# EAGLE design ME433_2017_1 (EAGLE 8.1.0)
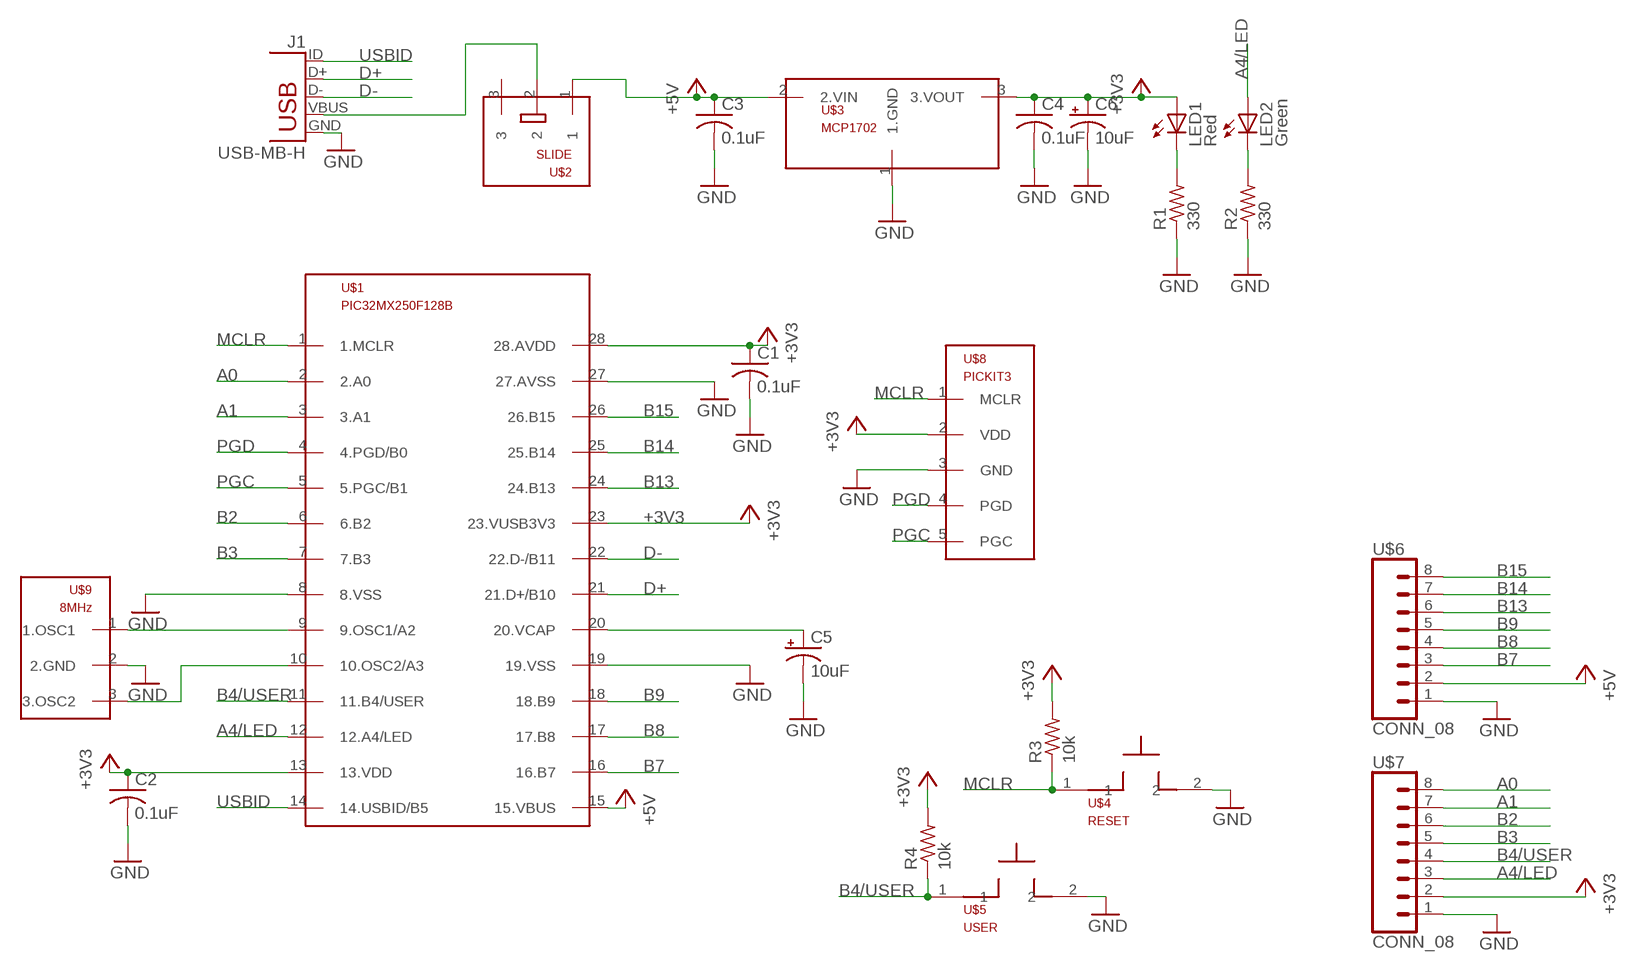
[diagram p0: schematic, sheet 1]

## Parts
C1  0.1uF  C-US025-025X050  [C025-025X050]
C2  0.1uF  C-US025-025X050  [C025-025X050]
C3  0.1uF  C-US025-025X050  [C025-025X050]
C4  0.1uF  C-US025-025X050  [C025-025X050]
C5  10uF  CPOL-USB45181B  [B45181B]
C6  10uF  CPOL-USB45181B  [B45181B]
J1  USB-MB-H  [USB-MB-H]
LED1  Red  LED3MM  [LED3MM]
LED2  Green  LED3MM  [LED3MM]
R1  330  R-US_0207/10  [0207/10]
R2  330  R-US_0207/10  [0207/10]
R3  10k  R-US_0207/10  [0207/10]
R4  10k  R-US_0207/10  [0207/10]
U$1  PIC32MX250F128B  [DIL28-3]
U$2  SLIDE  [SLIDE]
U$3  MCP1702  [TO92]
U$4  RESET  PB  [PB]
U$5  USER  PB  [PB]
U$6  CONN_08  [1X08]
U$7  CONN_08  [1X08]
U$8  PICKIT3  [1X05]
U$9  8MHz  OSC  [OSC]

## Nets
+3V3: C1.1 C2.1 C4.1 C6.+ LED1.A R3.2 R4.2 U$1.13(13.VDD) U$1.23(23.VUSB3V3) U$1.28(28.AVDD) U$3.3(3.VOUT) U$7.2 U$8.2(VDD)
+5V: C3.1 U$1.15(15.VBUS) U$2.1 U$3.2(2.VIN) U$6.2
A0: U$1.2(2.A0) U$7.8
A1: U$1.3(3.A1) U$7.7
A4/LED: LED2.A U$1.12(12.A4/LED) U$7.3
B2: U$1.6(6.B2) U$7.6
B3: U$1.7(7.B3) U$7.5
B4/USER: R4.1 U$1.11(11.B4/USER) U$5.1 U$7.4
B7: U$1.16(16.B7) U$6.3
B8: U$1.17(17.B8) U$6.4
B9: U$1.18(18.B9) U$6.5
B13: U$1.24(24.B13) U$6.6
B14: U$1.25(25.B14) U$6.7
B15: U$1.26(26.B15) U$6.8
D+: J1.D+ U$1.21(21.D+/B10)
D-: J1.D- U$1.22(22.D-/B11)
GND: C1.2 C2.2 C3.2 C4.2 C5.- C6.- J1.GND R1.1 R2.1 U$1.8(8.VSS) U$1.19(19.VSS) U$1.27(27.AVSS) U$3.1(1.GND) U$4.2 U$5.2 U$6.1 U$7.1 U$8.3(GND) U$9.2(2.GND)
MCLR: R3.1 U$1.1(1.MCLR) U$4.1 U$8.1(MCLR)
N$1: J1.VBUS U$2.2
N$2: LED2.K(C) R2.2
N$4: LED1.K(C) R1.2
N$5: U$1.9(9.OSC1/A2) U$9.1(1.OSC1)
N$6: U$1.10(10.OSC2/A3) U$9.3(3.OSC2)
N$7: C5.+ U$1.20(20.VCAP)
PGC: U$1.5(5.PGC/B1) U$8.5(PGC)
PGD: U$1.4(4.PGD/B0) U$8.4(PGD)
USBID: J1.ID U$1.14(14.USBID/B5)
Unconnected: U$2.3

## Library data of the parts
C1-C4 = resistor:C-US: CAPACITOR, American symbol
C5 C6 = resistor:CPOL-US: POLARIZED CAPACITOR, American symbol
J1 = ME433_2017_1:USB: USB Connectors USB-B-PTH is fully proven SKU : PRT-00139/CONN-08278 USB-miniB is fully proven SKU : PRT-00587 USB-A-PCB is untested. USB-A-H is throughly reviewed, but untested. Spark Fun Electronics SKU : PRT-00437 USB-B-SMT is throughly reviewed, but untested. Needs silkscreen touching up. USB-A-S has not been used/tested USB-MB-H has not been used/tested USB-MICROB has been used. CONN-09505
LED1 LED2 = led:LED: LED OSRAM: - CHIPLED LG R971, LG N971, LY N971, LG Q971, LY Q971, LO R971, LY R971 LH N974, LH R974 LS Q976, LO Q976, LY Q976 LO Q996 - Hyper CHIPLED LW Q18S LB Q993, LB Q99A, LB R99A - SideLED LS A670, LO A670, LY A670, LG A670, LP A670 LB A673, LV A673, LT A673, LW A673 LH A674 LY A675 LS A676, LA A676, LO A676, LY A676, LW A676 LS A679, LY A679, LG A679 - Hyper Micro SIDELED® LS Y876, LA Y876, LO Y876, LY Y876 LT Y87S - SmartLED LW L88C, LW L88S LB L89C, LB L89S, LG L890 LS L89K, LO L89K, LY L89K LS L896, LA L896, LO L896, LY L896 - TOPLED LS T670, LO T670, LY T670, LG T670, LP T670 LSG T670, LSP T670, LSY T670, LOP T670, LYG T670 LG T671, LOG T671, LSG T671 LB T673, LV T673, LT T673, LW T673 LH T674 LS T676, LA T676, LO T676, LY T676, LB T676, LH T676, LSB T676, LW T676 LB T67C, LV T67C, LT T67C, LS T67K, LO T67K, LY T67K, LW E67C LS E67B, LA E67B, LO E67B, LY E67B, LB E67C, LV E67C, LT E67C LW T67C LS T679, LY T679, LG T679 LS T770, LO T770, LY T770, LG T770, LP T770 LB T773, LV T773, LT T773, LW T773 LH T774 LS E675, LA E675, LY E675, LS T675 LS T776, LA T776, LO T776, LY T776, LB T776 LHGB T686 LT T68C, LB T68C - Hyper Mini TOPLED® LB M676 - Mini TOPLED Santana® LG M470 LS M47K, LO M47K, LY M47K Source: http://www.osram.convergy.de LUXEON: - LUMILED® LXK2-PW12-R00, LXK2-PW12-S00, LXK2-PW14-U00, LXK2-PW14-V00 LXK2-PM12-R00, LXK2-PM12-S00, LXK2-PM14-U00 LXK2-PE12-Q00, LXK2-PE12-R00, LXK2-PE12-S00, LXK2-PE14-T00, LXK2-PE14-U00 LXK2-PB12-K00, LXK2-PB12-L00, LXK2-PB12-M00, LXK2-PB14-N00, LXK2-PB14-P00, LXK2-PB14-Q00 LXK2-PR12-L00, LXK2-PR12-M00, LXK2-PR14-Q00, LXK2-PR14-R00 LXK2-PD12-Q00, LXK2-PD12-R00, LXK2-PD12-S00 LXK2-PH12-R00, LXK2-PH12-S00 LXK2-PL12-P00, LXK2-PL12-Q00, LXK2-PL12-R00 Source: www.luxeon.com KINGBRIGHT: KA-3528ASYC Source: www.kingbright.com
R1-R4 = resistor:R-US_: RESISTOR, American symbol
U$1 = ME433_2017_1:PIC32MX250F128B
U$2 = ME433_2017_1:SLIDE
U$3 = ME433_2017_1:MCP1702
U$4 U$5 = ME433_2017_1:PB
U$6 U$7 = ME433_2017_1:CONN_08
U$8 = ME433_2017_1:PICKIT3
U$9 = ME433_2017_1:OSC

## Board
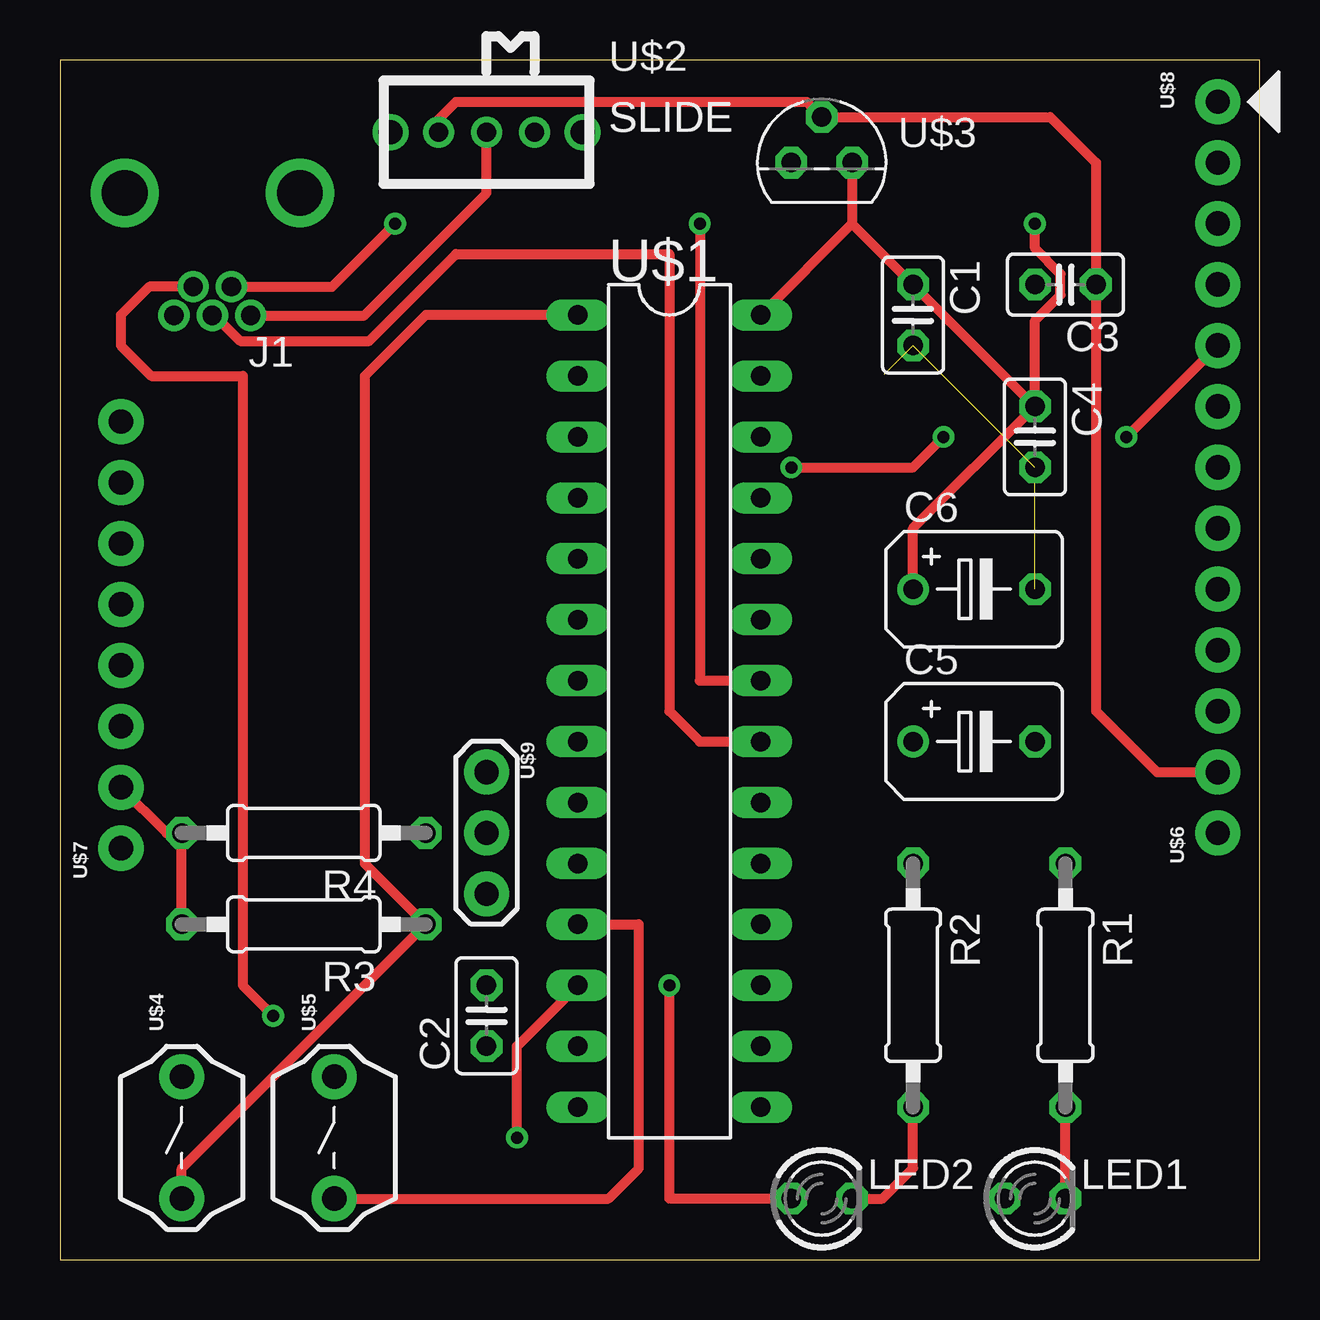
[diagram p1: board, top side]
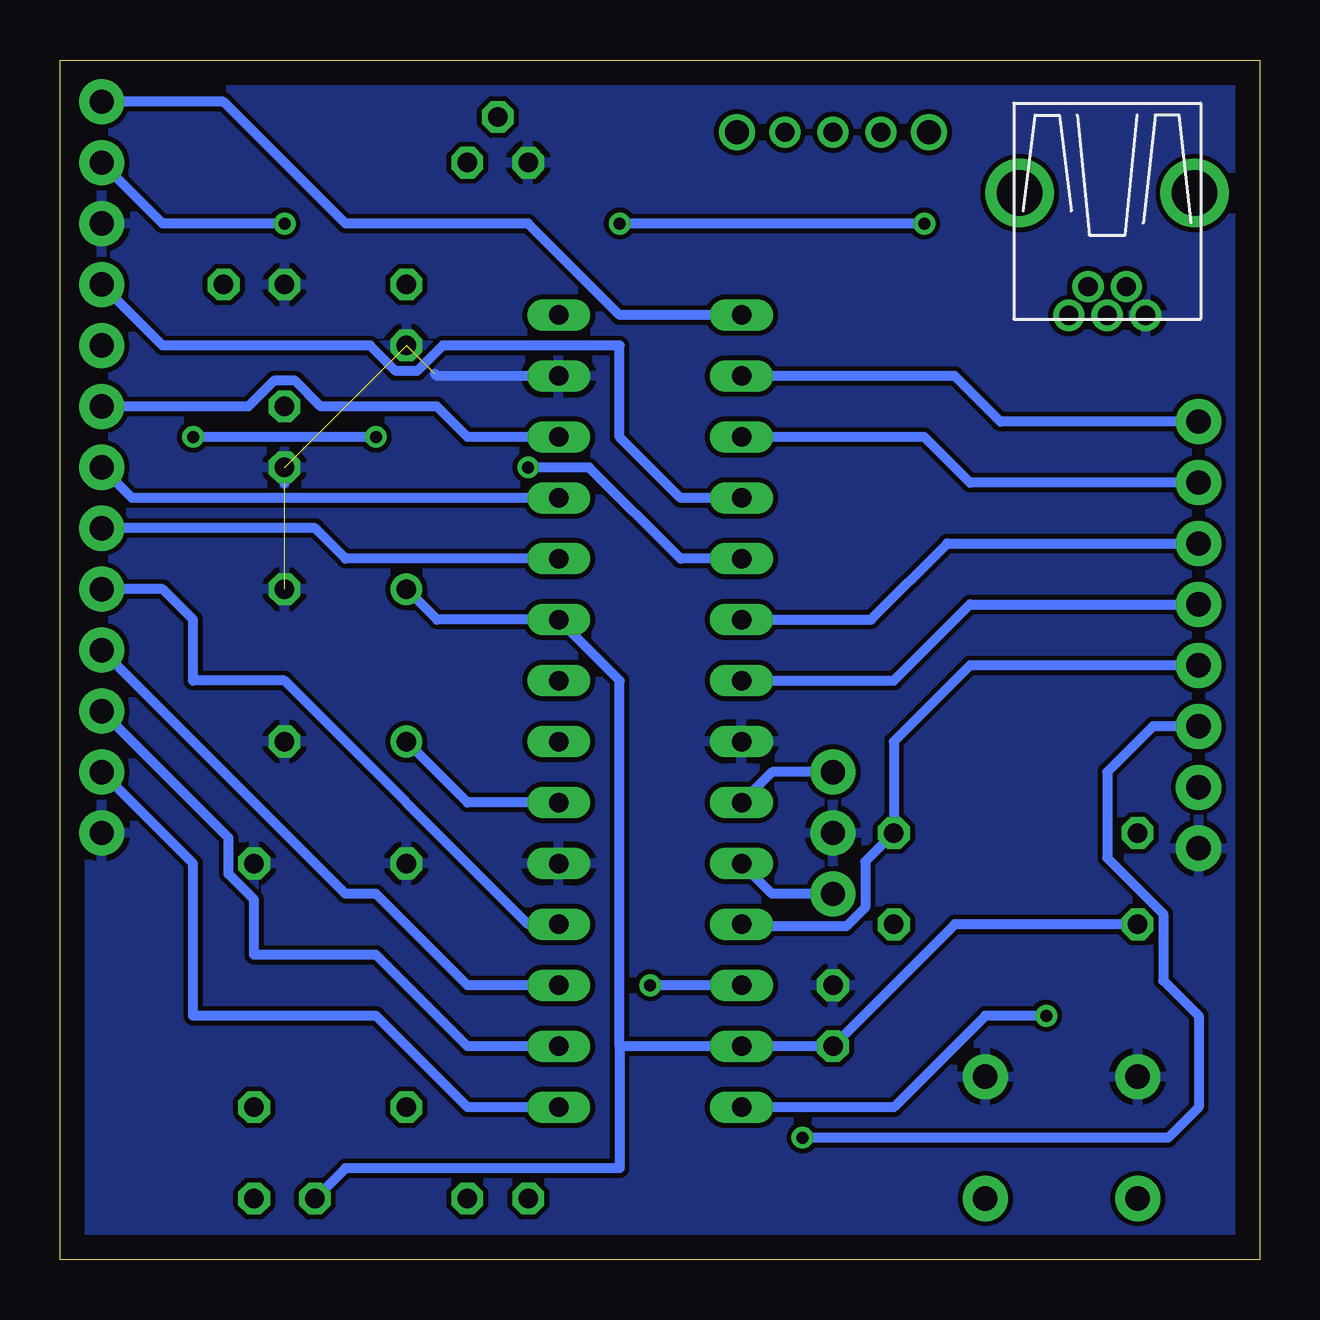
[diagram p2: board, bottom side, seen from below]

Size 50 x 50 mm. Coordinates in mm from the lower left corner, seen from the top.
Outline: 0,0 50,0 50,50 0,50 0,0
Copper layers (1*16): Top 0.035mm / dielectric 1.5mm / Bottom 0.035mm
Design rules "default": minimum track width 10mil, minimum drill 24mil, track to track 8mil, track to pad 8mil, pad to pad 8mil, via to via 8mil, smd to smd 8mil, copper to edge 40mil, drill to drill 8mil, minimum pad ring 10mil, minimum via ring 8mil, stop-mask expansion 4mil, vias tented up to drill 0mil, thermal gap 10mil

### Footprints (pad centres in the part's own frame; a part is rotated, then mirrored left to right if it is on the bottom)
C025-025X050 = drill 0.813 octagon: 1 -1.27,0; 2 1.27,0
B45181B = drill 0.813: + -2.54,0 | drill 0.813 octagon: - 2.54,0
USB-MB-H = drill 0.8: D+ 5.1,0; D- 3.9,0.8; GND 5.1,-1.6; ID 3.9,-0.8; VBUS 5.1,1.6 | drill 1.9: P$6 0,-3.65; P$7 0,3.65
LED3MM = drill 0.813 octagon: A -1.27,0; K 1.27,0
0207/10 = drill 0.813 octagon: 1 -5.08,0; 2 5.08,0
DIL28-3 = drill 0.813 long: 1 -16.51,-3.81; 2 -13.97,-3.81; 3 -11.43,-3.81; 4 -8.89,-3.81; 5 -6.35,-3.81; 6 -3.81,-3.81; 7 -1.27,-3.81; 8 1.27,-3.81; 9 3.81,-3.81; 10 6.35,-3.81; 11 8.89,-3.81; 12 11.43,-3.81; 13 13.97,-3.81; 14 16.51,-3.81; 15 16.51,3.81; 16 13.97,3.81; 17 11.43,3.81; 18 8.89,3.81; 19 6.35,3.81; 20 3.81,3.81; 21 1.27,3.81; 22 -1.27,3.81; 23 -3.81,3.81; 24 -6.35,3.81; 25 -8.89,3.81; 26 -11.43,3.81; 27 -13.97,3.81; 28 -16.51,3.81
SLIDE = drill 0.8: 1 -2,0; 2 0,0; 3 2,0 | drill 1: P$1 -4,0; P$2 4,0
TO92 = drill 0.813 octagon: 1 -1.27,0; 2 0,1.905; 3 1.27,0
PB = drill 1.016 pad 1.88: 1 -2.54,0; 2 2.54,0
1X08 = drill 1.016 pad 1.88: 1 0,0; 2 2.54,0; 3 5.08,0; 4 7.62,0; 5 10.16,0; 6 12.7,0; 7 15.24,0; 8 17.78,0
1X05 = drill 1.016 pad 1.88: 1 0,0; 2 2.54,0; 3 5.08,0; 4 7.62,0; 5 10.16,0
OSC = drill 1.016 pad 1.88: 1 -2.54,0; 2 0,0; 3 2.54,0

### Placement (x,y rotation side)
C1  35.56,39.37 270 top
C2  17.78,10.16 90 top
C3  41.91,40.64 180 top
C4  40.64,34.29 270 top
C5  38.1,21.59 0 top
C6  38.1,27.94 0 top
J1  6.35,44.45 270 top
LED1  40.64,2.54 0 top
LED2  31.75,2.54 0 top
R1  41.91,11.43 270 top
R2  35.56,11.43 270 top
R3  10.16,13.97 180 top
R4  10.16,17.78 180 top
U$1  25.4,22.86 270 top
U$2  17.78,46.99 0 top
U$3  31.75,45.72 0 top
U$4  5.08,5.08 90 top
U$5  11.43,5.08 90 top
U$6  48.26,17.78 90 top
U$7  2.54,17.14 90 top
U$8  48.26,48.26 270 top
U$9  17.78,17.78 270 top

### Tracks (layer width: path | path; a pad name or v marks a point on that pad's centre or on a via)
+3V3  (via drill 0.5)
  Top 0.406: U$3.3 33.02,43.18 | 33.02,43.18 C1.1 C4.1 | 33.02,43.18 U$1.28 | C6.+ 35.56,30.48 C4.1 | R3.2 R4.2 4.45,17.78 U$7.2 | C4.1 40.64,39.13 41.71,40.2 41.71,41.08 40.64,42.15 v40.64,43.18
  Bottom 0.406: R3.2 12.7,13.97 C2.1 U$1.13 26.67,8.89 | 26.67,8.89 26.67,3.81 38.1,3.81 LED1.A | 26.67,8.89 26.67,24.13 U$1.23 34.29,26.67 C6.+ | v40.64,43.18 45.72,43.18 U$8.2
+5V
  Top 0.406: U$2.1 15.78,47.53 16.51,48.26 31.11,48.26 U$3.2 41.27,47.62 43.18,45.72 C3.1 43.18,22.86 45.72,20.32 U$6.2
  Bottom 0.406: U$6.2 44.45,16.51 44.45,10.16 36.83,10.16 33.02,6.35 U$1.15
A0
  Bottom 0.406: U$7.8 10.79,34.92 12.7,36.83 U$1.2
A1
  Bottom 0.406: U$7.7 12.06,32.38 13.97,34.29 U$1.3
A4/LED  (via drill 0.5)
  Top 0.406: LED2.A 25.4,2.54 v25.4,11.43 | v19.05,5.08 19.05,8.89 U$1.12
  Bottom 0.406: U$1.12 v25.4,11.43 | U$7.3 4.45,22.23 6.35,20.32 6.35,16.75 4.01,14.41 4.01,11.63 2.54,10.16 2.54,6.35 3.81,5.08 v19.05,5.08
B2
  Bottom 0.406: U$1.6 16.19,26.67 13.02,29.84 U$7.6
B3
  Bottom 0.406: U$1.7 15.24,24.13 12.06,27.3 U$7.5
B4/USER
  Top 0.406: U$5.1 22.86,2.54 24.13,3.81 24.13,13.97 U$1.11
  Bottom 0.406: U$7.4 12.06,24.77 15.24,21.59 R4.1 16.43,16.59 16.43,14.68 17.22,13.89 21.14,13.89 21.22,13.97 U$1.11
B7
  Bottom 0.406: U$1.16 33.02,8.89 36.83,12.7 41.91,12.7 41.91,15 42.98,16.07 42.98,17.58 U$6.3
B8
  Bottom 0.406: U$1.17 33.02,11.43 36.83,15.24 38.1,15.24 U$6.4
B9
  Bottom 0.406: U$1.18 30.48,13.97 40.64,24.13 44.45,24.13 44.45,26.67 45.72,27.94 U$6.5
B13
  Bottom 0.406: U$1.24 38.1,29.21 39.37,30.48 U$6.6
B14
  Bottom 0.406: U$1.25 46.99,31.75 U$6.7
B15
  Bottom 0.406: U$1.26 33.02,34.29 34.29,35.56 39.13,35.56 40.2,36.63 41.08,36.63 42.15,35.56 U$6.8
D+
  Top 0.406: J1.D+ 6.45,39.35 7.51,38.29 12.89,38.29 16.51,41.91 25.4,41.91 25.4,22.86 26.67,21.59 U$1.21
D-  (via drill 0.5)
  Top 0.406: J1.D- 11.34,40.55 v13.97,43.18 | v26.67,43.18 26.67,24.13 U$1.22
  Bottom 0.406: v13.97,43.18 v26.67,43.18
GND  (3 unrouted)
  Bottom 0.406: U$1.27 34.29,36.83 34.38,36.91 | C4.2 40.64,32.36
  pour Bottom: -1.27,-1.27 52.07,-1.27 52.07,52.07 -1.27,52.07
MCLR
  Top 0.406: U$1.1 15.24,39.37 12.7,36.83 12.7,16.51 R3.1 5.08,3.81 U$4.1
  Bottom 0.406: U$1.1 26.67,39.37 30.48,43.18 38.1,43.18 43.18,48.26 U$8.1
N$1
  Top 0.406: J1.VBUS 12.68,39.35 17.78,44.45 U$2.2
N$2
  Top 0.406: LED2.K 34.29,2.54 35.56,3.81 R2.2
N$4
  Top 0.406: LED1.K R1.2
N$5
  Bottom 0.406: U$9.1 20.32,20.32 U$1.9
N$6
  Bottom 0.406: U$9.3 20.32,15.24 U$1.10
N$7
  Bottom 0.406: U$1.20 33.02,19.05 C5.+
PGC  (via drill 0.5)
  Top 0.406: v30.48,33.02 35.56,33.02 v36.83,34.29 | v44.45,34.29 U$8.5
  Bottom 0.406: U$1.5 24.13,29.21 27.94,33.02 v30.48,33.02 | v36.83,34.29 v44.45,34.29
PGD
  Bottom 0.406: U$1.4 24.13,31.75 26.67,34.29 26.67,38.1 34.05,38.1 35.12,37.03 36,37.03 37.07,38.1 45.72,38.1 U$8.4
USBID  (via drill 0.5)
  Top 0.406: J1.ID 3.72,40.55 2.54,39.37 2.54,38.1 3.81,36.83 7.62,36.83 7.62,11.43 v8.89,10.16
  Bottom 0.406: v8.89,10.16 11.43,10.16 15.24,6.35 U$1.14